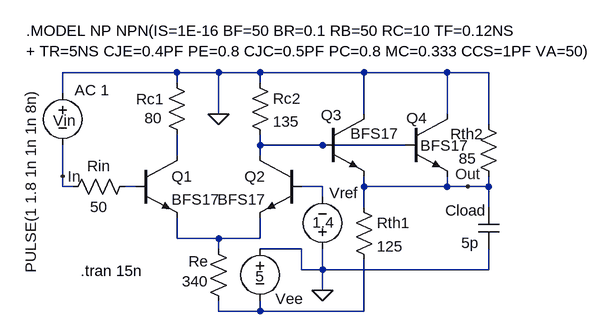
[diagram p0: schematic EclBuff.asc]
EclBuff.asc, the LTspice schematic file:
Version 4
SHEET 1 880 680
WIRE -160 112 -160 80
WIRE -160 240 -160 192
WIRE -160 256 -160 240
WIRE -144 256 -160 256
WIRE -48 256 -64 256
WIRE 16 80 -160 80
WIRE 16 96 16 80
WIRE 16 208 16 176
WIRE 16 336 16 304
WIRE 80 80 16 80
WIRE 80 144 80 80
WIRE 80 336 16 336
WIRE 80 352 80 336
WIRE 80 448 80 432
WIRE 144 80 80 80
WIRE 144 96 144 80
WIRE 144 192 144 176
WIRE 144 208 144 192
WIRE 144 336 80 336
WIRE 144 336 144 304
WIRE 144 448 80 448
WIRE 144 448 144 432
WIRE 208 352 144 352
WIRE 208 384 208 352
WIRE 240 192 144 192
WIRE 240 256 208 256
WIRE 240 272 240 256
WIRE 240 384 208 384
WIRE 240 384 240 352
WIRE 240 416 240 384
WIRE 304 80 144 80
WIRE 304 144 304 80
WIRE 304 256 304 240
WIRE 304 288 304 256
WIRE 304 448 144 448
WIRE 304 448 304 368
WIRE 368 192 240 192
WIRE 432 80 304 80
WIRE 432 144 432 80
WIRE 432 256 304 256
WIRE 432 256 432 240
WIRE 464 256 432 256
WIRE 496 80 432 80
WIRE 496 160 496 80
WIRE 496 256 464 256
WIRE 496 256 496 240
WIRE 496 288 496 256
WIRE 496 384 240 384
WIRE 496 384 496 352
FLAG 80 144 0
FLAG 240 416 0
FLAG 464 256 Out
FLAG -160 240 In
SYMBOL npn3 -48 208 R0
SYMATTR InstName Q1
SYMATTR Value BFS17
SYMBOL npn3 208 208 M0
SYMATTR InstName Q2
SYMATTR Value BFS17
SYMBOL res 64 336 R0
WINDOW 0 -30 35 Left 0
WINDOW 3 -40 66 Left 0
SYMATTR InstName Re
SYMATTR Value 340
SYMBOL res 0 80 R0
WINDOW 0 -47 41 Left 0
WINDOW 3 -34 70 Left 0
SYMATTR InstName Rc1
SYMATTR Value 80
SYMBOL res 128 80 R0
SYMATTR InstName Rc2
SYMATTR Value 135
SYMBOL res -48 240 R90
WINDOW 0 0 56 VBottom 0
WINDOW 3 32 56 VTop 0
SYMATTR InstName Rin
SYMATTR Value 50
SYMBOL npn3 240 144 R0
WINDOW 0 -2 2 Left 0
WINDOW 3 43 30 Left 0
SYMATTR InstName Q3
SYMATTR Value BFS17
SYMBOL npn3 368 144 R0
WINDOW 0 1 6 Left 0
WINDOW 3 23 49 Left 0
SYMATTR InstName Q4
SYMATTR Value BFS17
SYMBOL res 480 144 R0
WINDOW 0 -43 31 Left 0
WINDOW 3 -30 69 Left 0
SYMATTR InstName Rth2
SYMATTR Value 85
SYMBOL res 288 272 R0
SYMATTR InstName Rth1
SYMATTR Value 125
SYMBOL cap 480 288 R0
WINDOW 0 -51 5 Left 0
WINDOW 3 -26 55 Left 0
SYMATTR InstName Cload
SYMATTR Value 5p
SYMBOL voltage -160 96 R0
WINDOW 0 -15 58 Left 0
WINDOW 3 -49 10 VRight 0
WINDOW 123 72 11 Right 0
WINDOW 39 0 0 Left 0
SYMATTR InstName Vin
SYMATTR Value PULSE(1 1.8 1n 1n 1n 8n)
SYMATTR Value2 AC 1
SYMBOL voltage 240 368 R180
WINDOW 0 -55 102 Left 0
WINDOW 3 -18 57 Left 0
SYMATTR InstName Vref
SYMATTR Value 1.4
SYMBOL voltage 144 336 R0
WINDOW 0 24 93 Left 0
WINDOW 3 -7 58 Left 0
SYMATTR InstName Vee
SYMATTR Value 5
TEXT -216 16 Left 0 !.MODEL NP NPN(IS=1E-16 BF=50 BR=0.1 RB=50 RC=10 TF=0.12NS\n+ TR=5NS CJE=0.4PF PE=0.8 CJC=0.5PF PC=0.8 MC=0.333 CCS=1PF VA=50)
TEXT -132 386 Left 0 !.tran 15n

The netlist it stands for:
* EclBuff.asc
Q1 N002 N001 N003 0 BFS17
Q2 N005 N006 N003 0 BFS17
Re N003 N004 340
Rc1 0 N002 80
Rc2 0 N005 135
Rin N001 In 50
Q3 0 N005 Out 0 BFS17
Q4 0 N005 Out 0 BFS17
Rth2 0 Out 85
Rth1 Out N004 125
Cload Out 0 5p
Vin 0 In PULSE(1 1.8 1n 1n 1n 8n) AC 1
Vref 0 N006 1.4
Vee 0 N004 5
.model NPN NPN
.model PNP PNP
.lib standard.bjt
.MODEL NP NPN(IS=1E-16 BF=50 BR=0.1 RB=50 RC=10 TF=0.12NS
+ TR=5NS CJE=0.4PF PE=0.8 CJC=0.5PF PC=0.8 MC=0.333 CCS=1PF VA=50)
.tran 15n
.backanno
.end